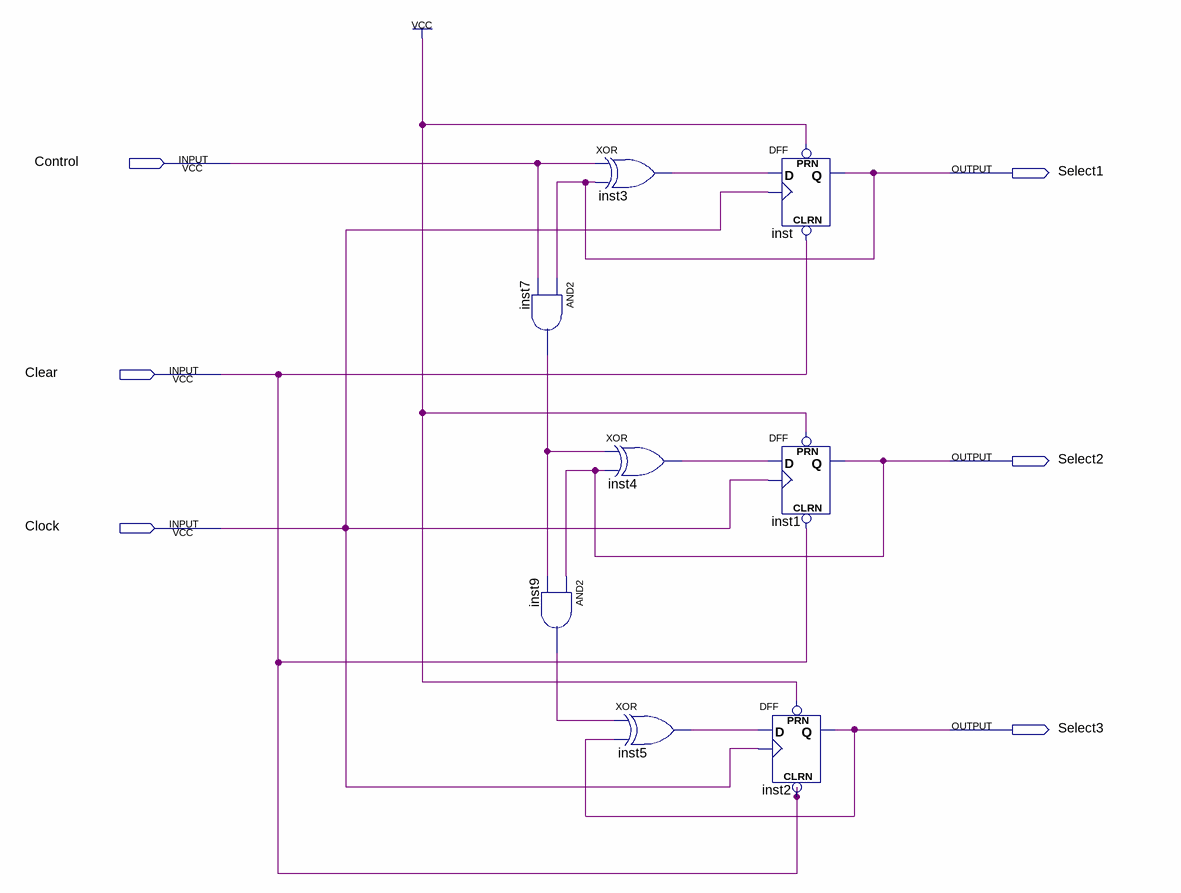
[diagram p0: schematic sheet]
// Quartus schematic State_machine.bdf as structural Verilog: 8 symbols, 6 pins
module State_machine (
  input  Control,
  input  Clear,
  input  Clock,
  output Select1,
  output Select2,
  output Select3
);

  wire inst3_out, inst4_out, inst5_out, inst7_out, inst9_out;

  and inst7 (inst7_out, Select1, Control);
  and inst9 (inst9_out, Select2, inst7_out);
  xor inst3 (inst3_out, Control, Select1);
  xor inst4 (inst4_out, inst7_out, Select2);
  xor inst5 (inst5_out, inst9_out, Select3);
  DFF inst (.CLRN(Clear), .CLK(Clock), .D(inst3_out), .PRN(1'b1), .Q(Select1));
  DFF inst1 (.CLRN(Clear), .CLK(Clock), .D(inst4_out), .PRN(1'b1), .Q(Select2));
  DFF inst2 (.CLRN(Clear), .CLK(Clock), .D(inst5_out), .PRN(1'b1), .Q(Select3));
endmodule
